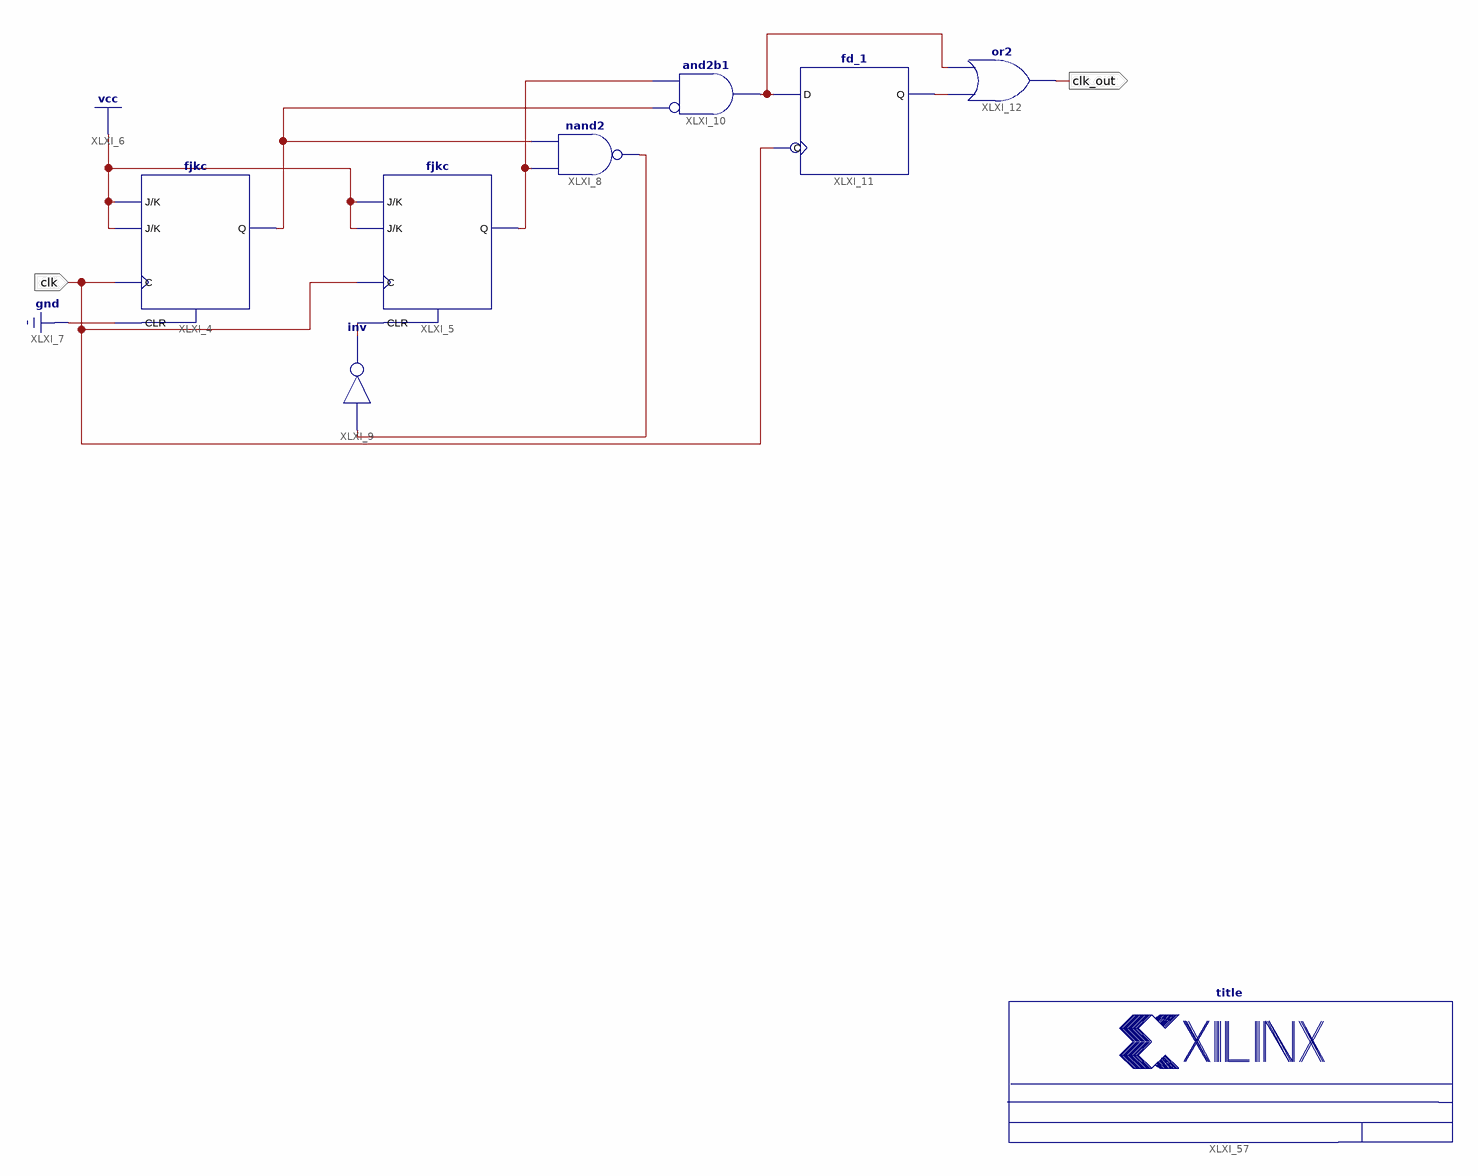
[diagram p0: schematic sheet 1]
// Xilinx ISE schematic CLKDIV_3.sch (spartan3e) as structural Verilog: 8 symbols, 2 ports
module CLKDIV_3 (
  input  clk,
  output clk_out
);

  wire q0, q1, XLXN_12, XLXN_13, XLXN_21, XLXN_22;

  fjkc XLXI_4 (.C(clk), .CLR(1'b0), .J(1'b1), .K(1'b1), .Q(q0));
  fjkc XLXI_5 (.C(clk), .CLR(XLXN_12), .J(1'b1), .K(1'b1), .Q(q1));
  nand XLXI_8 (XLXN_13, q1, q0);
  not XLXI_9 (XLXN_12, XLXN_13);
  and XLXI_10 (XLXN_21, ~q0, q1);  // and2b1
  fd_1 XLXI_11 (.C(clk), .D(XLXN_21), .Q(XLXN_22));
  or XLXI_12 (clk_out, XLXN_22, XLXN_21);
  title #(.TitleFieldText("Clock divided by 3 with 75% Duty Cycle"), .NameFieldText("Karthik Vippala")) XLXI_57 ();
endmodule
